# Altium project PLD.PrjPcb (part 2 of 2)

## Sheet PLD_Thermometers_PT1000.SchDoc: Thermometers
size A4; ApprovedBy: Piotr Kuligowski; CheckedBy: Michal Gumiela; Author: Grzegorz Gajoch; DocumentNumber: PWSat2-xxx-DW-xxx; Revision: 1; SheetTotal: 32; Model: DM1
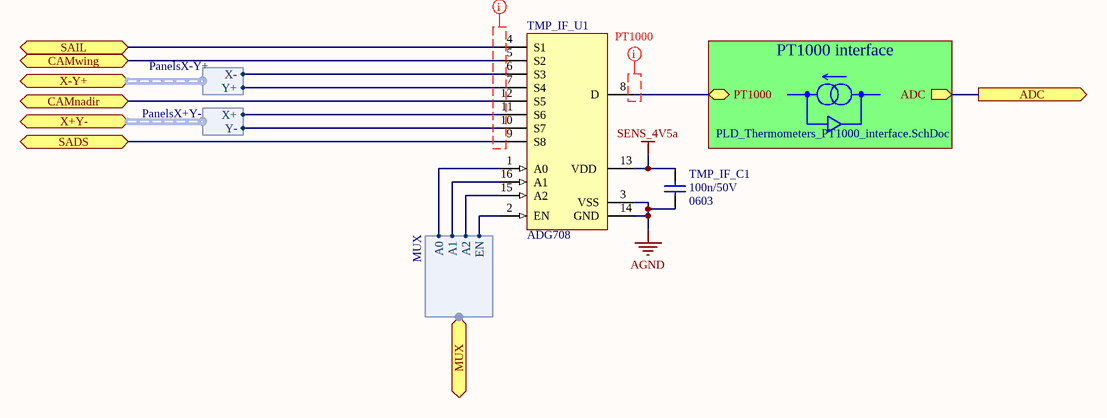
[diagram p16: PLD_Thermometers_PT1000.SchDoc]

### Parts
TMP_IF_C1  Package: 0603  [SMD_Capacitor_0603]  (hidden comment: 100n/50V)
TMP_IF_U1  ADG708  [TSSOP16]

### Sub-sheets
PT1000 interface = PLD_Thermometers_PT1000_interface.SchDoc: ADC (out), PT1000 (bidir)

### Ports
ADC (out), CAMnadir, CAMwing, MUX (harness MUX), SADS, SAIL, X+Y- (harness PanelsX+Y-), X-Y+ (harness PanelsX-Y+)

### Harnesses
MUX: A0, A1, A2, EN
PanelsX+Y-: X+, Y-
PanelsX-Y+: X-, Y+

### Nets
AGND: TMP_IF_C1.2 TMP_IF_U1.3(VSS) TMP_IF_U1.14(GND)
SENS_4V5a: TMP_IF_C1.1 TMP_IF_U1.13(VDD)
A0: TMP_IF_U1.1(A0) ; port MUX.A0
A1: TMP_IF_U1.16(A1) ; port MUX.A1
A2: TMP_IF_U1.15(A2) ; port MUX.A2
EN: TMP_IF_U1.2(EN) ; port MUX.EN
PT1000_SADS: TMP_IF_U1.9(S8) ; port SADS
PT1000_SAIL: TMP_IF_U1.4(S1) ; port SAIL
NetADC_C8_1: TMP_IF_U1.8(D) ; port ADC, sheet PT1000 interface/ADC, sheet PT1000 interface/PT1000
NetCONN_H3_6: TMP_IF_U1.5(S2) ; port CAMwing
NetCONN_H4_5: TMP_IF_U1.10(S7) ; port X+Y-.Y-
NetCONN_H4_7: TMP_IF_U1.11(S6) ; port X+Y-.X+
NetCONN_H5_6: TMP_IF_U1.12(S5) ; port CAMnadir
NetCONN_H6_6: TMP_IF_U1.7(S4) ; port X-Y+.Y+
NetCONN_H6_8: TMP_IF_U1.6(S3) ; port X-Y+.X-

### Layout directives
net class PT1000: (no net found under the mark)

### Notes on the sheet
- Title:
- Project:
- Author:
- Model:
- Document Number:
- Checked by:
- Rev:
- Date:
- Approved by:
- Sheet:
- of
- File name:

### Library data of the parts
TMP_IF_C1 = Cer_C0603T104K5RALTU: Ceramic Cap Kemet COTS 100n/50V X7R 0603; Manufacturer: Kemet; ManufacturerPartNumber: C0603T104K5RALTU; Value: 100n/50V
TMP_IF_U1 = ADG708: CMOS Analog 8:1 Multiplexer; Manufacturer: Analog Devices; ManufacturerPartNumber: ADG708

## Sheet PLD_Thermometers_PT1000_interface.SchDoc: Thermometers
size A4; ApprovedBy: Piotr Kuligowski; CheckedBy: Michal Gumiela; Author: Grzegorz Gajoch; DocumentNumber: PWSat2-xxx-DW-xxx; Revision: 1; SheetTotal: 32; Model: DM1
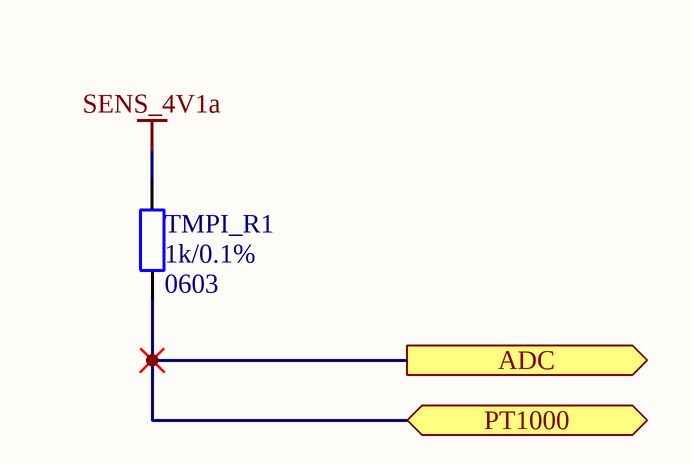
[diagram p17: PLD_Thermometers_PT1000_interface.SchDoc]

### Parts
TMPI_R1  Package: 0603  [SMD_Resistor_0603]  (hidden comment: 1k/0.1%)

### Ports
ADC (out), PT1000 (bidir)

### Nets
SENS_4V1a: TMPI_R1.2
NetADC_C8_1: TMPI_R1.1 ; port PT1000, port ADC

### Notes on the sheet
- Title:
- Project:
- Author:
- Model:
- Document Number:
- Checked by:
- Rev:
- Date:
- Approved by:
- Sheet:
- of
- File name:

### Library data of the parts
TMPI_R1 = Res: Value: 1k/0.1%

## Sheet PLD_ADC_MUX.SchDoc: RadFET
size A4; ApprovedBy: Piotr Kuligowski; CheckedBy: Michal Gumiela; Author: Grzegorz Gajoch; DocumentNumber: PWSat2-xxx-DW-xxx; Revision: 1; SheetTotal: 32; Model: DM1
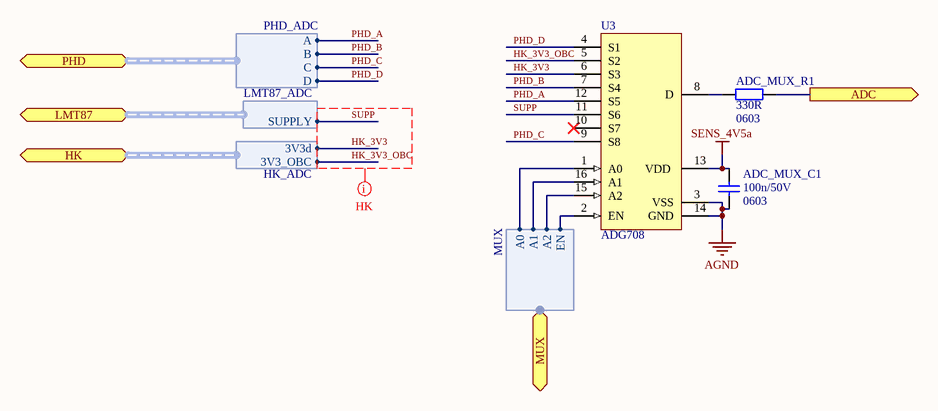
[diagram p18: PLD_ADC_MUX.SchDoc]

### Parts
ADC_MUX_C1  Package: 0603  [SMD_Capacitor_0603]  (hidden comment: 100n/50V)
ADC_MUX_R1  Package: 0603  [SMD_Resistor_0603]  (hidden comment: 330R)
U3  ADG708  [TSSOP16]

### Ports
ADC (out), HK (harness HK_ADC), LMT87 (harness LMT87_ADC), MUX (harness MUX), PHD (harness PHD_ADC)

### Harnesses
MUX: A0, A1, A2, EN
HK_ADC: 3V3_OBC, 3V3d
LMT87_ADC: SUPPLY
PHD_ADC: A, B, C, D

### Nets
AGND: ADC_MUX_C1.2 U3.3(VSS) U3.14(GND)
SENS_4V5a: ADC_MUX_C1.1 U3.13(VDD)
A0: U3.1(A0) ; port MUX.A0
A1: U3.16(A1) ; port MUX.A1
A2: U3.15(A2) ; port MUX.A2
EN: U3.2(EN) ; port MUX.EN
HK_3V3: U3.6(S3) ; port HK.3V3d
HK_3V3_OBC: U3.5(S2) ; port HK.3V3_OBC
PHD_A: U3.12(S5) ; port PHD.A
PHD_B: U3.7(S4) ; port PHD.B
PHD_C: U3.9(S8) ; port PHD.C
PHD_D: U3.4(S1) ; port PHD.D
SUPP: U3.11(S6) ; port LMT87.SUPPLY  [project net LMT87_SUPPLY]
NetADC_C7_1: ADC_MUX_R1.2 ; port ADC
NetADC_MUX_R1_1: ADC_MUX_R1.1 U3.8(D)

Not connected (* = marked no-connect by the designer): U3 10(S7)*

### Layout directives
net class HK: HK_3V3, HK_3V3_OBC, SUPP

### Notes on the sheet
- Title:
- Project:
- Author:
- Model:
- Document Number:
- Checked by:
- Rev:
- Date:
- Approved by:
- Sheet:
- of
- File name:

### Library data of the parts
ADC_MUX_C1 = Cer_C0603T104K5RALTU: Ceramic Cap Kemet COTS 100n/50V X7R 0603; Manufacturer: Kemet; ManufacturerPartNumber: C0603T104K5RALTU; Value: 100n/50V
ADC_MUX_R1 = Res: Value: 330R
U3 = ADG708: as TMP_IF_U1 on sheet PLD_Thermometers_PT1000; ManufacturerPartNumber: ADG708

## Sheet PLD_FRAM-Memory.SchDoc: Flash Memory
size A4; ApprovedBy: Piotr Kuligowski; CheckedBy: Michal Gumiela; Author: Grzegorz Gajoch; DocumentNumber: PWSat2-xxx-DW-xxx; Revision: 1; SheetTotal: 32; Model: DM1
Used 3 times, as channels PLD Top/FRAM Memory 1, PLD Top/FRAM Memory 2, PLD Top/FRAM Memory 3. Parts and nets are listed once, with the designators drawn on the sheet.
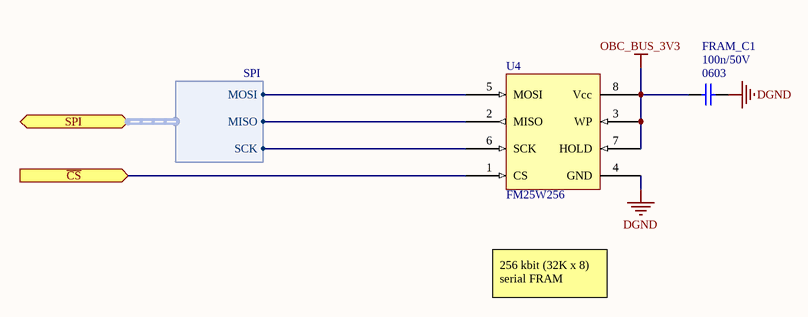
[diagram p19: PLD_FRAM-Memory.SchDoc]

### Parts
FRAM_C1  Package: 0603  [SMD_Capacitor_0603]  (hidden comment: 100n/50V)
U4  FM25W256  [SOIC-8-N]

### Ports
SPI (harness SPI), ~{CS} (in)

### Harnesses
SPI: MISO, MOSI, SCK

### Nets
DGND: FRAM_C1.1 U4.4(GND)
OBC_BUS_3V3: FRAM_C1.2 U4.3(WP) U4.7(HOLD) U4.8(Vcc)
~{CS}: U4.1(CS) ; port ~{CS}
NetU4_2: U4.2(MISO) ; port SPI.MISO
NetU4_5: U4.5(MOSI) ; port SPI.MOSI
NetU4_6: U4.6(SCK) ; port SPI.SCK

### Channels
PLD Top/FRAM Memory 1: designators end in _FRAM_Memory_1; ports ~{CS}=NetU4_FRAM_Memory_1_1
PLD Top/FRAM Memory 2: designators end in _FRAM_Memory_2; ports ~{CS}=NetU4_FRAM_Memory_2_1
PLD Top/FRAM Memory 3: designators end in _FRAM_Memory_3; ports ~{CS}=NetU4_FRAM_Memory_3_1

### Notes on the sheet
- 256 kbit (32K x 8) serial FRAM
- Title:
- Project:
- Author:
- Model:
- Document Number:
- Checked by:
- Rev:
- Date:
- Approved by:
- Sheet:
- of
- File name:

### Library data of the parts
FRAM_C1 = Cer_C0603T104K5RALTU: Ceramic Cap Kemet COTS 100n/50V X7R 0603; Manufacturer: Kemet; ManufacturerPartNumber: C0603T104K5RALTU; Value: 100n/50V
U4 = FM25W256: 256Kb (8k x 32) SPI F-RAM

## Sheet PLD_AcessPortInterface.SchDoc: ADC for SunSref,Photodiodes and HK
size A4; ApprovedBy: Piotr Kuligowski; CheckedBy: Michal Gumiela; Author: Grzegorz Gajoch; DocumentNumber: PWSat2-xxx-DW-xxx; Revision: 1; SheetTotal: 32; Model: DM1
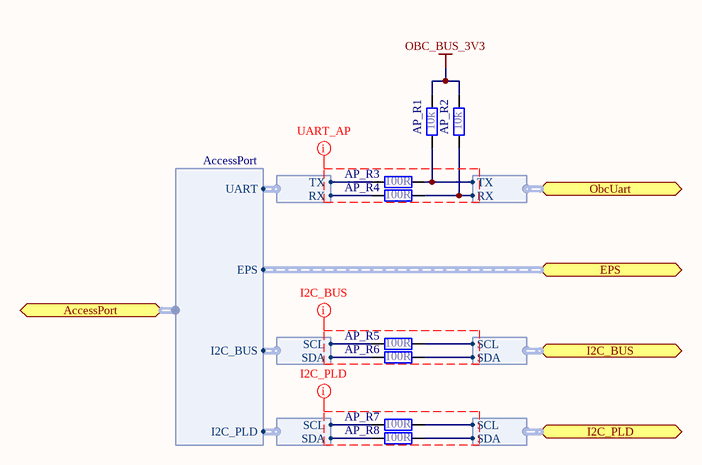
[diagram p20: PLD_AcessPortInterface.SchDoc]

### Parts
AP_R1  10k  [SMD_Resistor_0603]
AP_R2  10k  [SMD_Resistor_0603]
AP_R3  100R  [SMD_Resistor_0603]
AP_R4  100R  [SMD_Resistor_0603]
AP_R5  100R  [SMD_Resistor_0603]
AP_R6  100R  [SMD_Resistor_0603]
AP_R7  100R  [SMD_Resistor_0603]
AP_R8  100R  [SMD_Resistor_0603]

### Ports
AccessPort (harness AccessPort), EPS (harness EPS_ACCESSPORT), I2C_BUS (harness I2C), I2C_PLD (harness I2C), ObcUart (harness UART)

### Harnesses
I2C: SDA, SCL
UART: RX, TX
AccessPort: I2C_PLD, I2C_BUS, EPS, UART

### Nets
OBC_BUS_3V3: AP_R1.2 AP_R2.2
PC-104_I2C-Bus-SCL: AP_R5.2 ; port I2C_BUS.SCL
PC-104_I2C-Bus-SDA: AP_R6.2 ; port I2C_BUS.SDA
PC-104_I2C-Payload_SCL: AP_R7.2 ; port I2C_PLD.SCL
PC-104_I2C-Payload_SDA: AP_R8.2 ; port I2C_PLD.SDA
NetAP_R1_1: AP_R1.1 AP_R3.2 ; port ObcUart.TX
NetAP_R2_1: AP_R2.1 AP_R4.2 ; port ObcUart.RX
NetAP_R3_1: AP_R3.1 ; harness UART.TX
NetAP_R4_1: AP_R4.1 ; harness UART.RX
NetAP_R5_1: AP_R5.1 ; harness I2C.SCL
NetAP_R6_1: AP_R6.1 ; harness I2C.SDA
NetAP_R7_1: AP_R7.1 ; harness I2C.SCL
NetAP_R8_1: AP_R8.1 ; harness I2C.SDA

### Layout directives
net class I2C_BUS: (no net found under the mark)
net class I2C_PLD: (no net found under the mark)
net class UART_AP: (no net found under the mark)

### Notes on the sheet
- Title:
- Project:
- Author:
- Model:
- Document Number:
- Checked by:
- Rev:
- Date:
- Approved by:
- Sheet:
- of
- File name:

### Library data of the parts
AP_R1-AP_R8 = Res: Package: 0603
  AP_R1 AP_R2: Value: 10k
  AP_R3-AP_R8: Value: 100R

## Sheet PLD_Connectors_PC-104.SchDoc: Connectors - PC-104
size A4; ApprovedBy: Piotr Kuligowski; CheckedBy: Michal Gumiela; Author: Grzegorz Gajoch; DocumentNumber: PWSat2-xxx-DW-xxx; Revision: 1; SheetTotal: 32; Model: DM1
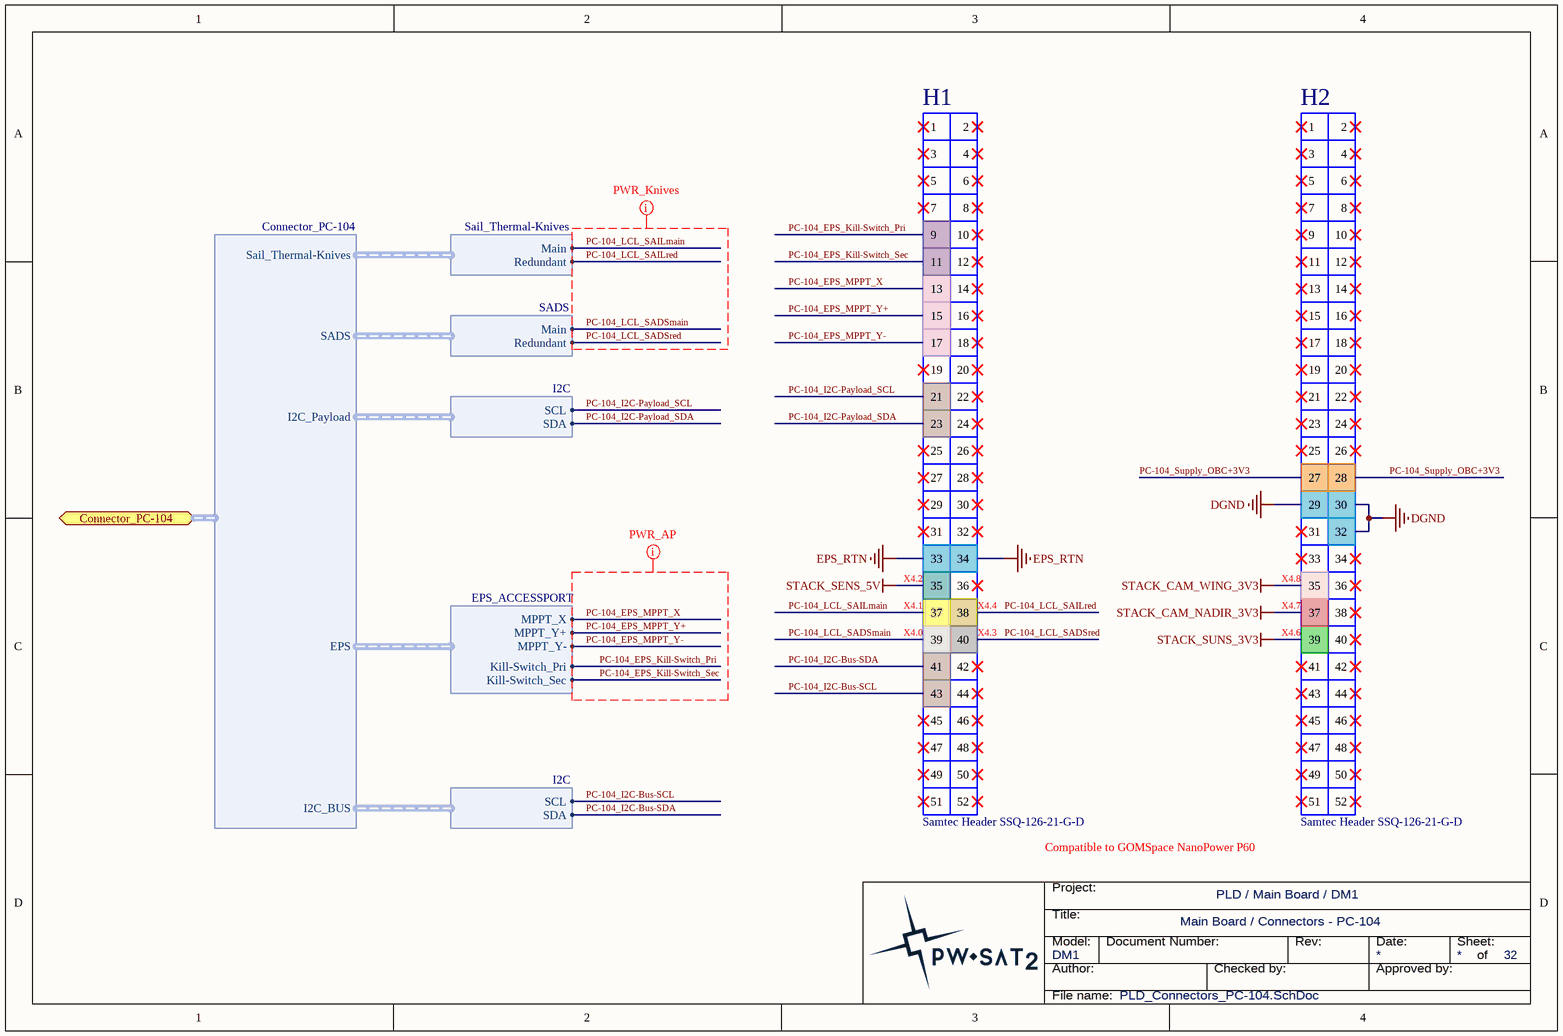
[diagram p21: PLD_Connectors_PC-104.SchDoc]

### Parts
H1  Samtec Header SSQ-126-21-G-D  [Samtec_SSQ-126-21-G-D]
H2  Samtec Header SSQ-126-21-G-D  [Samtec_SSQ-126-21-G-D]

### Ports
Connector_PC-104 (harness Connector_PC-104)

### Harnesses
Connector_PC-104: I2C_Payload, Sail_Thermal-Knives, SADS, I2C_BUS, EPS
Sail_Thermal-Knives: Main, Redundant
SADS: Main, Redundant
I2C: SDA, SCL
EPS_ACCESSPORT: MPPT_X, MPPT_Y+, MPPT_Y-, Kill-Switch_Pri, Kill-Switch_Sec

### Nets
DGND: H2.29 H2.30 H2.32
EPS_RTN: H1.33 H1.34
STACK_CAM_NADIR_3V3: H2.37
STACK_CAM_WING_3V3: H2.35
STACK_SENS_5V: H1.35
STACK_SUNS_3V3: H2.39
PC-104_EPS_Kill-Switch_Pri: H1.9 ; harness EPS_ACCESSPORT.Kill-Switch_Pri
PC-104_EPS_Kill-Switch_Sec: H1.11 ; harness EPS_ACCESSPORT.Kill-Switch_Sec
PC-104_EPS_MPPT_X: H1.13 ; harness EPS_ACCESSPORT.MPPT_X
PC-104_EPS_MPPT_Y+: H1.15 ; harness EPS_ACCESSPORT.MPPT_Y+
PC-104_EPS_MPPT_Y-: H1.17 ; harness EPS_ACCESSPORT.MPPT_Y-
PC-104_I2C-Bus-SCL: H1.43 ; harness I2C.SCL
PC-104_I2C-Bus-SDA: H1.41 ; harness I2C.SDA
PC-104_I2C-Payload_SCL: H1.21 ; harness I2C.SCL
PC-104_I2C-Payload_SDA: H1.23 ; harness I2C.SDA
PC-104_LCL_SADSmain: H1.39 ; harness SADS.Main
PC-104_LCL_SADSred: H1.40 ; harness SADS.Redundant
PC-104_LCL_SAILmain: H1.37 ; harness Sail_Thermal-Knives.Main
PC-104_LCL_SAILred: H1.38 ; harness Sail_Thermal-Knives.Redundant
PC-104_Supply_OBC+3V3: H2.27 H2.28

Not connected (* = marked no-connect by the designer): H1 1* 2* 3* 4* 5* 6* 7* 8* 10* 12* 14* 16* 18* 19* 20* 22* 24* 25* 26* 27* 28* 29* 30* 31* 32* 36* 42* 44* 45* 46* 47* 48* 49* 50* 51* 52*; H2 1* 2* 3* 4* 5* 6* 7* 8* 9* 10* 11* 12* 13* 14* 15* 16* 17* 18* 19* 20* 21* 22* 23* 24* 25* 26* 31* 33* 34* 36* 38* 40* 41* 42* 43* 44* 45* 46* 47* 48* 49* 50* 51* 52*

### Layout directives
net class PWR_Knives: PC-104_LCL_SADSmain, PC-104_LCL_SADSred, PC-104_LCL_SAILmain, PC-104_LCL_SAILred
net class PWR_AP: PC-104_EPS_Kill-Switch_Pri, PC-104_EPS_Kill-Switch_Sec, PC-104_EPS_MPPT_X, PC-104_EPS_MPPT_Y+, PC-104_EPS_MPPT_Y-

### Notes on the sheet
- (near H1) X4.2
- (near H2) X4.8
- (near H1) X4.1
- (near H1) X4.0
- (near H1) X4.4
- (near H1) X4.3
- (near H2) X4.7
- (near H2) X4.6
- Compatible to GOMSpace NanoPower P60
- Title:
- Project:
- Author:
- Model:
- Document Number:
- Checked by:
- Rev:
- Date:
- Approved by:
- Sheet:
- of
- File name:

### Library data of the parts
H1 H2 = Samtec_SSQ-126-xx-x-D: Samtec SSQ Series Header , 2.54mm pitch, 2x26pin. PC-104 Stack Connector.; HelpUrl: http://suddendocs.samtec.com/catalog_english/ssq_th.pdf; Value: Samtec Header SSQ-126-21-G-D

## Sheet PLD_Connectors_Piggyback.SchDoc: Connectors - Piggyback
size A4; ApprovedBy: Piotr Kuligowski; CheckedBy: Michal Gumiela; Author: Grzegorz Gajoch; DocumentNumber: PWSat2-xxx-DW-xxx; Revision: 1; SheetTotal: 32; Model: DM1
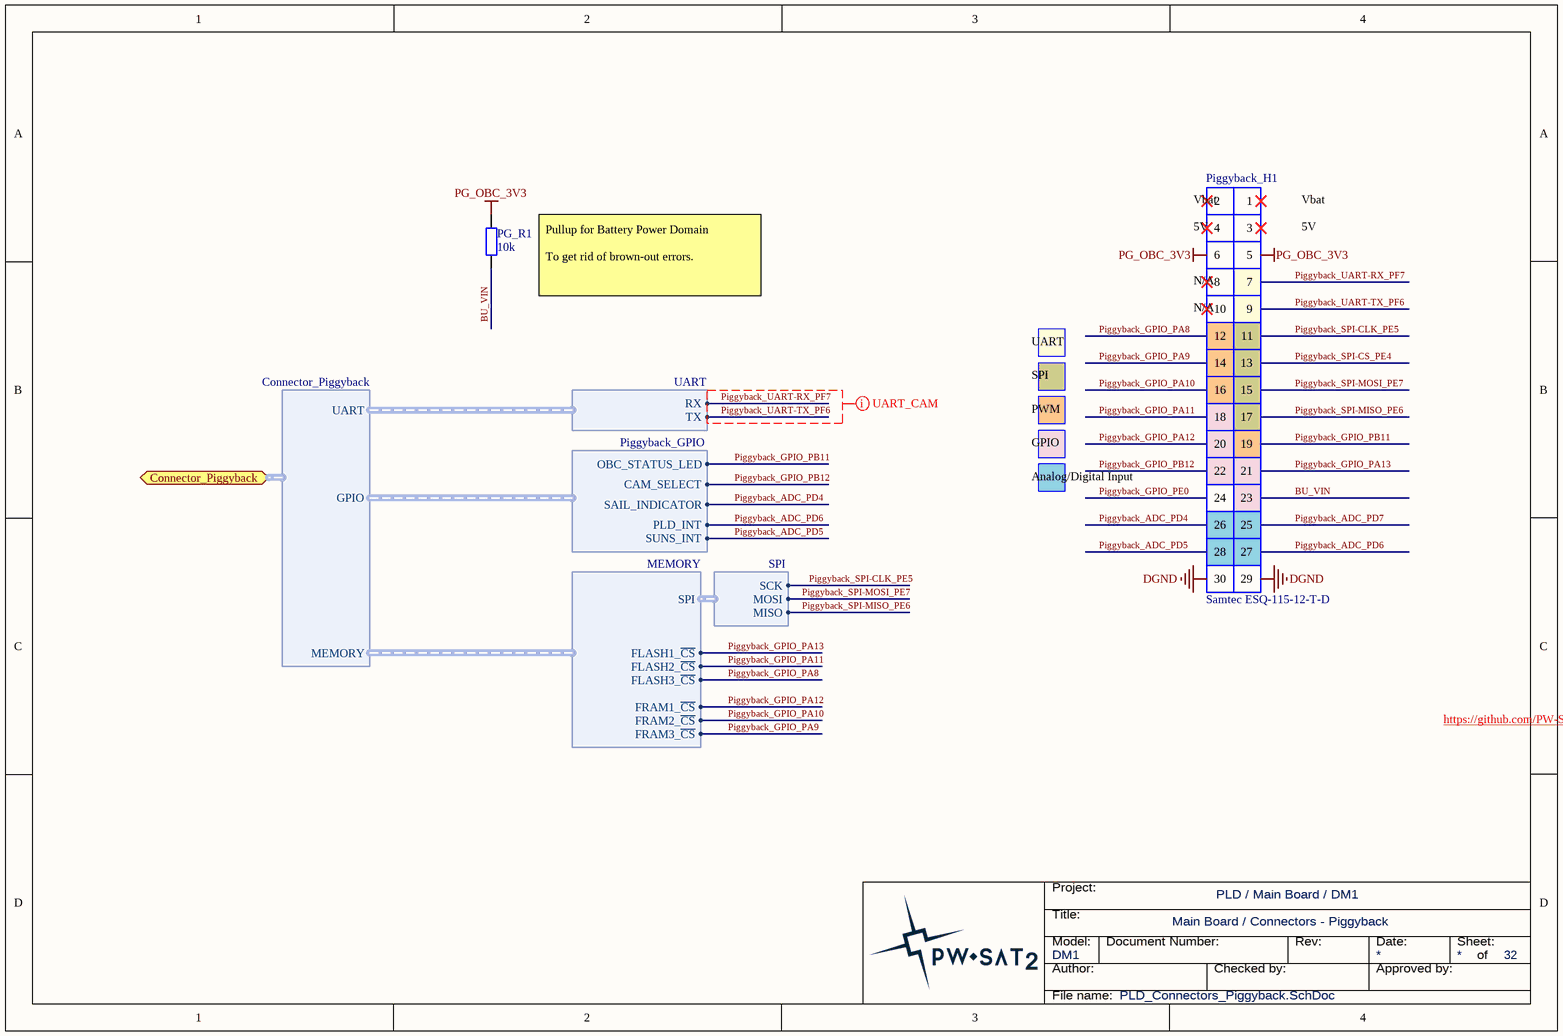
[diagram p22: PLD_Connectors_Piggyback.SchDoc]

### Parts
PG_R1  10k  [SMD_Resistor_0603]
Piggyback_H1  Samtec ESQ-115-12-T-D  [Samtec_ESQ-115-12-T-D]

### Ports
Connector_Piggyback (harness Connector_Piggyback)

### Harnesses
SPI: MISO, MOSI, SCK
UART: RX, TX
Connector_Piggyback: UART, GPIO, MEMORY
Piggyback_GPIO: CAM_SELECT, PLD_INT, SAIL_INDICATOR, SUNS_INT, OBC_STATUS_LED
MEMORY: SPI, FLASH1_~{CS}, FRAM1_~{CS}, FLASH2_~{CS}, FLASH3_~{CS}, FRAM2_~{CS}, FRAM3_~{CS}

### Nets
DGND: Piggyback_H1.29 Piggyback_H1.30
PG_OBC_3V3: PG_R1.2 Piggyback_H1.5 Piggyback_H1.6
BU_VIN: PG_R1.1 Piggyback_H1.23
Piggyback_ADC_PD4: Piggyback_H1.26 ; harness Piggyback_GPIO.SAIL_INDICATOR
Piggyback_ADC_PD5: Piggyback_H1.28 ; harness Piggyback_GPIO.SUNS_INT
Piggyback_ADC_PD6: Piggyback_H1.27 ; harness Piggyback_GPIO.PLD_INT  [project net INT]
Piggyback_ADC_PD7: Piggyback_H1.25
Piggyback_GPIO_PA8: Piggyback_H1.12 ; harness MEMORY.FLASH3_~{CS}
Piggyback_GPIO_PA9: Piggyback_H1.14 ; harness MEMORY.FRAM3_~{CS}
Piggyback_GPIO_PA10: Piggyback_H1.16 ; harness MEMORY.FRAM2_~{CS}
Piggyback_GPIO_PA11: Piggyback_H1.18 ; harness MEMORY.FLASH2_~{CS}
Piggyback_GPIO_PA12: Piggyback_H1.20 ; harness MEMORY.FRAM1_~{CS}
Piggyback_GPIO_PA13: Piggyback_H1.21 ; harness MEMORY.FLASH1_~{CS}
Piggyback_GPIO_PB11: Piggyback_H1.19 ; harness Piggyback_GPIO.OBC_STATUS_LED  [project net OBC_STATUS_LED]
Piggyback_GPIO_PB12: Piggyback_H1.22 ; harness Piggyback_GPIO.CAM_SELECT
Piggyback_GPIO_PE0: Piggyback_H1.24
Piggyback_SPI-CLK_PE5: Piggyback_H1.11 ; harness SPI.SCK
Piggyback_SPI-CS_PE4: Piggyback_H1.13
Piggyback_SPI-MISO_PE6: Piggyback_H1.17 ; harness SPI.MISO
Piggyback_SPI-MOSI_PE7: Piggyback_H1.15 ; harness SPI.MOSI
Piggyback_UART-RX_PF7: Piggyback_H1.7 ; harness UART.RX
Piggyback_UART-TX_PF6: Piggyback_H1.9 ; harness UART.TX

Not connected (* = marked no-connect by the designer): Piggyback_H1 1* 2* 3* 4* 8* 10*

### Layout directives
net class UART_CAM: Piggyback_UART-RX_PF7, Piggyback_UART-TX_PF6

### Notes on the sheet
- (near Piggyback_H1) Vbat
- (near Piggyback_H1) 5V
- (near PG_R1) Pullup for Battery Power Domain
  To get rid of brown-out errors.
- (near Piggyback_H1) N/A
- SPI
- UART
- PWM
- GPIO
- Analog/Digital Input
- https://github.com/PW-Sat2/Documentation/raw/master/obc/obc_datasheet_esl_cubecomputer.pdf
- Title:
- Project:
- Author:
- Model:
- Document Number:
- Checked by:
- Rev:
- Date:
- Approved by:
- Sheet:
- of
- File name:

### Library data of the parts
PG_R1 = Res: Value: 10k; Package: 0603
Piggyback_H1 = Samtec_ESQ-115-xx-x-D: Samtec ESQ Series Header , 2.54mm pitch, 2x15pin. PC-104 Stack Connector.; HelpUrl: http://suddendocs.samtec.com/catalog_english/esq_th.pdf; Value: Samtec ESQ-115-12-T-D

## Nets that join several sheets
AGND: PLD_Connectors (14 pins), PLD_Top (SADS_RTD1.1), PLD_RadFET (RF_J1.1), PLD_RadFET_Current_Source (RF_C8.2 RF_U4.2), PLD_SunSref-Interface (5 pins), PLD_ADC (12 pins), PLD_Thermometers_PT1000 (TMP_IF_C1.2 TMP_IF_U1.3 TMP_IF_U1.14), PLD_ADC_MUX (ADC_MUX_C1.2 U3.3 U3.14)
CAM_nadir_3V3: PLD_Connectors (CONN_H5.2), PLD_CAM_MUX (MUX_C2.1 MUX_R7.1 MUX_R8.1 MUX_U2.7)
CAM_wing_3V3: PLD_Connectors (CONN_H3.2), PLD_CAM_MUX (MUX_C1.1 MUX_R1.2 MUX_R2.2 MUX_U1.7)
DGND: PLD_Connectors (23 pins), PLD_Top (OBC_D1.2), PLD_RadFET_Supply (RF_R13.1), PLD Top/RadFET/Radfet Supply/LCL 3V3d (RF_C22_LCL_3V3d.2 RF_R19_LCL_3V3d.1 RF_R20_LCL_3V3d.1 RF_U9_LCL_3V3d.2), PLD_Sensors_AVR_Interface (17 pins), PLD_AVR_Watchdog (RF_C20.2 RF_C21.2 RF_R22.1 RF_U10.2), PLD_CAM_MUX (8 pins), PLD_ADC (6 pins), PLD_Gyroscopes (9 pins), PLD Top/Flash Memory 3 (Flash_C1_Flash_Memory_3.1 Flash_U1_Flash_Memory_3.4), PLD Top/FRAM Memory 1 (FRAM_C1_FRAM_Memory_1.1 U4_FRAM_Memory_1.4), PLD Top/Flash Memory 2 (Flash_C1_Flash_Memory_2.1 Flash_U1_Flash_Memory_2.4), PLD Top/Flash Memory 1 (Flash_C1_Flash_Memory_1.1 Flash_U1_Flash_Memory_1.4), PLD Top/FRAM Memory 2 (FRAM_C1_FRAM_Memory_2.1 U4_FRAM_Memory_2.4), PLD Top/FRAM Memory 3 (FRAM_C1_FRAM_Memory_3.1 U4_FRAM_Memory_3.4), PLD_Connectors_PC-104 (H2.29 H2.30 H2.32), PLD_Connectors_Piggyback (Piggyback_H1.29 Piggyback_H1.30)
EPS_RTN: PLD_Connectors (CONN_H2.2 CONN_H2.6 CONN_H8.1 CONN_H9.1), PLD_Connectors_PC-104 (H1.33 H1.34)
OBC_BUS_3V3: PLD Top/Flash Memory 3 (Flash_C1_Flash_Memory_3.2 Flash_U1_Flash_Memory_3.3 Flash_U1_Flash_Memory_3.7 Flash_U1_Flash_Memory_3.8), PLD Top/FRAM Memory 1 (FRAM_C1_FRAM_Memory_1.2 U4_FRAM_Memory_1.3 U4_FRAM_Memory_1.7 U4_FRAM_Memory_1.8), PLD_AcessPortInterface (AP_R1.2 AP_R2.2), PLD Top/Flash Memory 2 (Flash_C1_Flash_Memory_2.2 Flash_U1_Flash_Memory_2.3 Flash_U1_Flash_Memory_2.7 Flash_U1_Flash_Memory_2.8), PLD Top/Flash Memory 1 (Flash_C1_Flash_Memory_1.2 Flash_U1_Flash_Memory_1.3 Flash_U1_Flash_Memory_1.7 Flash_U1_Flash_Memory_1.8), PLD Top/FRAM Memory 2 (FRAM_C1_FRAM_Memory_2.2 U4_FRAM_Memory_2.3 U4_FRAM_Memory_2.7 U4_FRAM_Memory_2.8), PLD Top/FRAM Memory 3 (FRAM_C1_FRAM_Memory_3.2 U4_FRAM_Memory_3.3 U4_FRAM_Memory_3.7 U4_FRAM_Memory_3.8)
OBC_PLD_3V3: PLD_CAM_MUX (8 pins), PLD_Gyroscopes (Gyro_C3.1 Gyro_FB1.1 Gyro_U1.8)
RAD_4V5a: PLD_RadFET_Supply (6 pins), PLD_RadFET_Current_Source (RF_C8.1 RF_R3.1 RF_U4.5), PLD_RadFET_Mux (RF_C10.1 RF_U6.14)
RF_AGND: PLD_RadFET (RF_J1.2), PLD_RadFET_Supply (10 pins), PLD Top/RadFET/Radfet Supply/LCL 5V (RF_C22_LCL_5V.2 RF_R19_LCL_5V.1 RF_R20_LCL_5V.1 RF_U9_LCL_5V.2), PLD_RadFET_Current_Source (RF_C9.1), PLD_RadFET_Mux (RF_C10.2 RF_U6.3 RF_U6.9 RF_U6.15), PLD_RadFET_Differential_Lowpass (RF_C17.1 RF_C19.2)
SENS_3V3d: PLD Top/RadFET/Radfet Supply/LCL 3V3d (RF_U9_LCL_3V3d.1), PLD_Sensors_AVR_Interface (21 pins), PLD_AVR_Watchdog (RF_C20.1 RF_R21.2 RF_R28.2 RF_U10.4), PLD_ADC (5 pins)
SENS_4V1a: PLD_ADC (ADC_C5.1 ADC_C10.1 ADC_U1.2), PLD_Thermometers_PT1000_interface (TMPI_R1.2)
SENS_4V5a: PLD_Thermometers_PT1000 (TMP_IF_C1.1 TMP_IF_U1.13), PLD_ADC_MUX (ADC_MUX_C1.1 U3.13)
A0: PLD_Sensors_AVR_Interface (AVR_U1.42 MCU_R5.2), PLD_Thermometers_PT1000 (TMP_IF_U1.1), PLD_ADC_MUX (U3.1)
A1: PLD_Sensors_AVR_Interface (AVR_U1.40 MCU_R6.2), PLD_Thermometers_PT1000 (TMP_IF_U1.16), PLD_ADC_MUX (U3.16)
A2: PLD_Sensors_AVR_Interface (AVR_U1.41 MCU_R7.2), PLD_Thermometers_PT1000 (TMP_IF_U1.15), PLD_ADC_MUX (U3.15)
ADC128_~{CS}: PLD_Sensors_AVR_Interface (AVR_U1.9 MCU_R1.2), PLD_ADC (ADC_R3.2)
EN: PLD_Sensors_AVR_Interface (AVR_U1.43 MCU_R8.2), PLD_Thermometers_PT1000 (TMP_IF_U1.2), PLD_ADC_MUX (U3.2)
INT: PLD_Sensors_AVR_Interface (AVR_U1.10 MCU_R13.1), PLD_Connectors_Piggyback (Piggyback_H1.27)
MISO: PLD_Sensors_AVR_Interface (AVR_U1.2 MCU_R3.2), PLD_ADC (ADC_R1.2)
MOSI: PLD_Sensors_AVR_Interface (AVR_U1.1 MCU_R2.2), PLD_ADC (ADC_R2.2)
NetADC_C1_1: PLD_SunSref-Interface (SunSref_R1.2 SunSref_R2.2), PLD_ADC (ADC_C1.1 ADC_U1.4)
NetADC_C2_1: PLD_SunSref-Interface (SunSref_R9.2 SunSref_R10.2), PLD_ADC (ADC_C2.1 ADC_U1.5)
NetADC_C3_1: PLD_SunSref-Interface (SunSref_R3.2 SunSref_R4.2), PLD_ADC (ADC_C3.1 ADC_U1.6)
NetADC_C4_1: PLD_SunSref-Interface (SunSref_R7.2 SunSref_R8.2), PLD_ADC (ADC_C4.1 ADC_U1.7)
NetADC_C6_1: PLD_SunSref-Interface (SunSref_R5.2 SunSref_R6.2), PLD_ADC (ADC_C6.1 ADC_U1.8)
NetADC_C7_1: PLD_ADC (ADC_C7.1 ADC_U1.9), PLD_ADC_MUX (ADC_MUX_R1.2)
NetADC_C8_1: PLD_ADC (ADC_C8.1 ADC_U1.10), PLD_Thermometers_PT1000 (TMP_IF_U1.8), PLD_Thermometers_PT1000_interface (TMPI_R1.1)
NetAP_R1_1: PLD_Connectors (CONN_P1.1), PLD_AcessPortInterface (AP_R1.1 AP_R3.2)
NetAP_R2_1: PLD_Connectors (CONN_P1.2), PLD_AcessPortInterface (AP_R2.1 AP_R4.2)
NetAP_R3_1: PLD_Connectors (CONN_H7.7), PLD_AcessPortInterface (AP_R3.1)
NetAP_R4_1: PLD_Connectors (CONN_H7.8), PLD_AcessPortInterface (AP_R4.1)
NetAP_R5_1: PLD_Connectors (CONN_H7.4), PLD_AcessPortInterface (AP_R5.1)
NetAP_R6_1: PLD_Connectors (CONN_H7.3), PLD_AcessPortInterface (AP_R6.1)
NetAP_R7_1: PLD_Connectors (CONN_H7.2), PLD_AcessPortInterface (AP_R7.1)
NetAP_R8_1: PLD_Connectors (CONN_H7.1), PLD_AcessPortInterface (AP_R8.1)
NetCONN_H1_1: PLD_Connectors (CONN_H1.1), PLD_SunSref-Interface (SunSref_R7.1)
NetCONN_H1_2: PLD_Connectors (CONN_H1.2), PLD_SunSref-Interface (SunSref_R5.1)
NetCONN_H1_4: PLD_Connectors (CONN_H1.4), PLD_SunSref-Interface (SunSref_R1.1)
NetCONN_H1_6: PLD_Connectors (CONN_H1.6), PLD_SunSref-Interface (SunSref_R3.1)
NetCONN_H1_7: PLD_Connectors (CONN_H1.7), PLD_SunSref-Interface (SunSref_R9.1)
NetCONN_H3_1: PLD_Connectors (CONN_H3.1), PLD_CAM_MUX (MUX_R1.1 MUX_R4.2)
NetCONN_H3_4: PLD_Connectors (CONN_H3.4), PLD_CAM_MUX (MUX_R2.1 MUX_R3.2)
NetCONN_H3_6: PLD_Connectors (CONN_H3.6), PLD_Thermometers_PT1000 (TMP_IF_U1.5)
NetCONN_H4_5: PLD_Connectors (CONN_H4.5), PLD_Thermometers_PT1000 (TMP_IF_U1.10)
NetCONN_H4_7: PLD_Connectors (CONN_H4.7), PLD_Thermometers_PT1000 (TMP_IF_U1.11)
NetCONN_H5_1: PLD_Connectors (CONN_H5.1), PLD_CAM_MUX (MUX_R7.2 MUX_R10.1)
NetCONN_H5_4: PLD_Connectors (CONN_H5.4), PLD_CAM_MUX (MUX_R8.2 MUX_R9.1)
NetCONN_H5_6: PLD_Connectors (CONN_H5.6), PLD_Thermometers_PT1000 (TMP_IF_U1.12)
NetCONN_H6_6: PLD_Connectors (CONN_H6.6), PLD_Thermometers_PT1000 (TMP_IF_U1.7)
NetCONN_H6_8: PLD_Connectors (CONN_H6.8), PLD_Thermometers_PT1000 (TMP_IF_U1.6)
NetFlash_U1_Flash_Memory_1_2: PLD Top/Flash Memory 3 (Flash_U1_Flash_Memory_3.2), PLD Top/FRAM Memory 1 (U4_FRAM_Memory_1.2), PLD Top/Flash Memory 2 (Flash_U1_Flash_Memory_2.2), PLD Top/Flash Memory 1 (Flash_U1_Flash_Memory_1.2), PLD Top/FRAM Memory 2 (U4_FRAM_Memory_2.2), PLD Top/FRAM Memory 3 (U4_FRAM_Memory_3.2)
NetFlash_U1_Flash_Memory_1_5: PLD Top/Flash Memory 3 (Flash_U1_Flash_Memory_3.5), PLD Top/FRAM Memory 1 (U4_FRAM_Memory_1.5), PLD Top/Flash Memory 2 (Flash_U1_Flash_Memory_2.5), PLD Top/Flash Memory 1 (Flash_U1_Flash_Memory_1.5), PLD Top/FRAM Memory 2 (U4_FRAM_Memory_2.5), PLD Top/FRAM Memory 3 (U4_FRAM_Memory_3.5)
NetFlash_U1_Flash_Memory_1_6: PLD Top/Flash Memory 3 (Flash_U1_Flash_Memory_3.6), PLD Top/FRAM Memory 1 (U4_FRAM_Memory_1.6), PLD Top/Flash Memory 2 (Flash_U1_Flash_Memory_2.6), PLD Top/Flash Memory 1 (Flash_U1_Flash_Memory_1.6), PLD Top/FRAM Memory 2 (U4_FRAM_Memory_2.6), PLD Top/FRAM Memory 3 (U4_FRAM_Memory_3.6)
NetMCU_R16_2: PLD Top/RadFET/Radfet Supply/LCL 5V (RF_R8_LCL_5V.1 RF_U9_LCL_5V.4), PLD_Sensors_AVR_Interface (MCU_R16.2)
NetMCU_R17_2: PLD Top/RadFET/Radfet Supply/LCL 3V3d (RF_R8_LCL_3V3d.1 RF_U9_LCL_3V3d.4), PLD_Sensors_AVR_Interface (MCU_R17.2)
NetRF_FB1_2: PLD_RadFET_Supply (RF_FB1.2), PLD Top/RadFET/Radfet Supply/LCL 5V (RF_R20_LCL_5V.2 RF_U9_LCL_5V.6)
NetRF_R15_1: PLD_RadFET_Mux (RF_U6.8), PLD_RadFET_Differential_Lowpass (RF_R15.1)
OBC_STATUS_LED: PLD_Top (OBC_R1.2), PLD_Connectors_Piggyback (Piggyback_H1.19)
PC-104_EPS_Kill-Switch_Pri: PLD_Connectors (CONN_H7.12), PLD_Connectors_PC-104 (H1.9)
PC-104_EPS_Kill-Switch_Sec: PLD_Connectors (CONN_H7.6), PLD_Connectors_PC-104 (H1.11)
PC-104_EPS_MPPT_X: PLD_Connectors (CONN_H7.10), PLD_Connectors_PC-104 (H1.13)
PC-104_EPS_MPPT_Y+: PLD_Connectors (CONN_H7.11), PLD_Connectors_PC-104 (H1.15)
PC-104_EPS_MPPT_Y-: PLD_Connectors (CONN_H7.5), PLD_Connectors_PC-104 (H1.17)
PC-104_I2C-Bus-SCL: PLD_AcessPortInterface (AP_R5.2), PLD_Connectors_PC-104 (H1.43)
PC-104_I2C-Bus-SDA: PLD_AcessPortInterface (AP_R6.2), PLD_Connectors_PC-104 (H1.41)
PC-104_I2C-Payload_SCL: PLD_AcessPortInterface (AP_R7.2), PLD_Connectors_PC-104 (H1.21)
PC-104_I2C-Payload_SDA: PLD_AcessPortInterface (AP_R8.2), PLD_Connectors_PC-104 (H1.23)
PC-104_LCL_SADSmain: PLD_Connectors (CONN_H8.2), PLD_Connectors_PC-104 (H1.39)
PC-104_LCL_SADSred: PLD_Connectors (CONN_H9.2), PLD_Connectors_PC-104 (H1.40)
Piggyback_ADC_PD5: PLD_Connectors (CONN_H10.3), PLD_Connectors_Piggyback (Piggyback_H1.28)
Piggyback_GPIO_PB12: PLD_CAM_MUX (MUX_R14.2), PLD_Connectors_Piggyback (Piggyback_H1.22)
Piggyback_UART-RX_PF7: PLD_CAM_MUX (MUX_R6.1 MUX_R12.2 MUX_R16.1), PLD_Connectors_Piggyback (Piggyback_H1.7)
Piggyback_UART-TX_PF6: PLD_CAM_MUX (MUX_R5.1 MUX_R11.2 MUX_R15.1), PLD_Connectors_Piggyback (Piggyback_H1.9)
PT1000_SADS: PLD_Top (SADS_RTD1.2), PLD_Thermometers_PT1000 (TMP_IF_U1.9)
~{RST}: PLD_Sensors_AVR_Interface (AVR_C6.1 AVR_P1.6 AVR_U1.4 R1.2), PLD_AVR_Watchdog (RF_U10.6)
RadFET_EN: PLD_RadFET_Supply (RF_R13.2), PLD Top/RadFET/Radfet Supply/LCL 5V (RF_R9_LCL_5V.2), PLD Top/RadFET/Radfet Supply/LCL 3V3d (RF_R9_LCL_3V3d.2), PLD_Sensors_AVR_Interface (AVR_U1.35)
RadFET_MUX_A0: PLD_RadFET_Mux (RF_R24.1), PLD_Sensors_AVR_Interface (AVR_U1.14)
RadFET_MUX_A1: PLD_RadFET_Mux (RF_R6.1), PLD_Sensors_AVR_Interface (AVR_U1.15)
RadFET_MUX_EN: PLD_RadFET_Mux (RF_R23.1), PLD_Sensors_AVR_Interface (AVR_U1.13)
SCK: PLD_Sensors_AVR_Interface (AVR_U1.3 MCU_R4.2), PLD_ADC (ADC_R6.2)
WDG: PLD_Sensors_AVR_Interface (AVR_U1.44), PLD_AVR_Watchdog (RF_U10.1)